# EAGLE board v8g (EAGLE 9.0.1), part 1 of 2
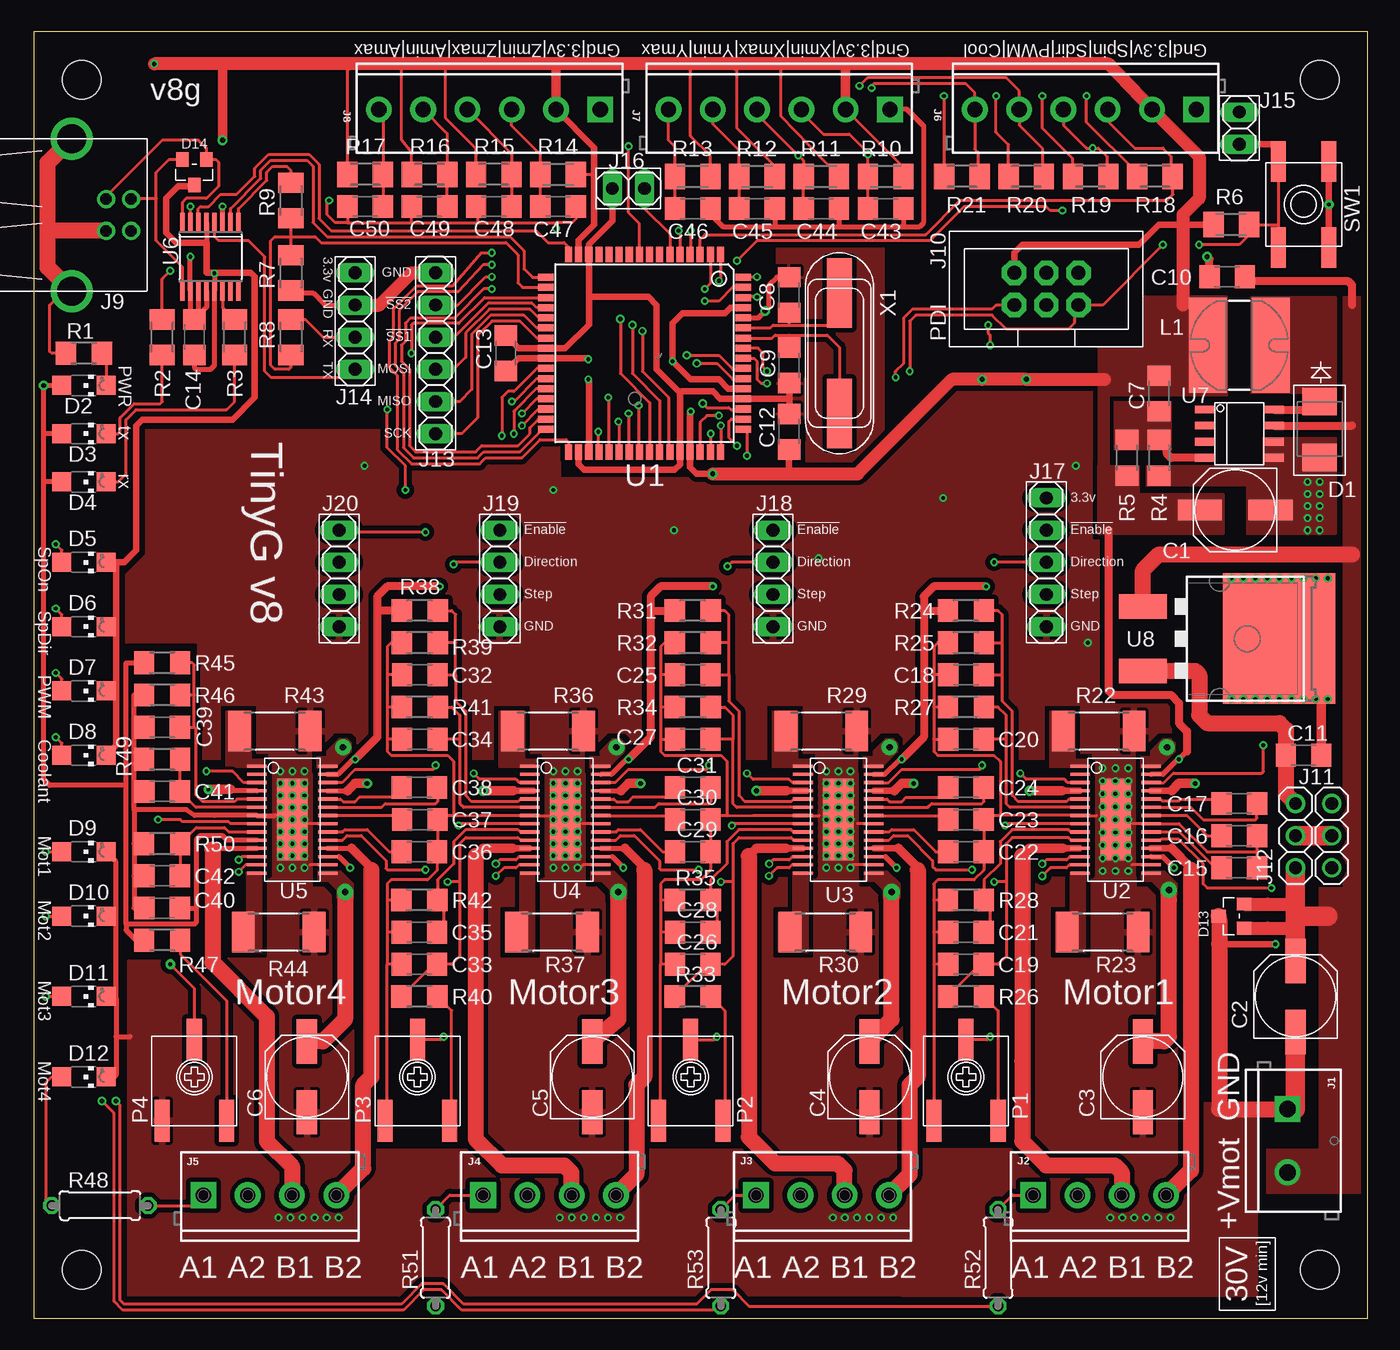
[diagram p4: board, top side]
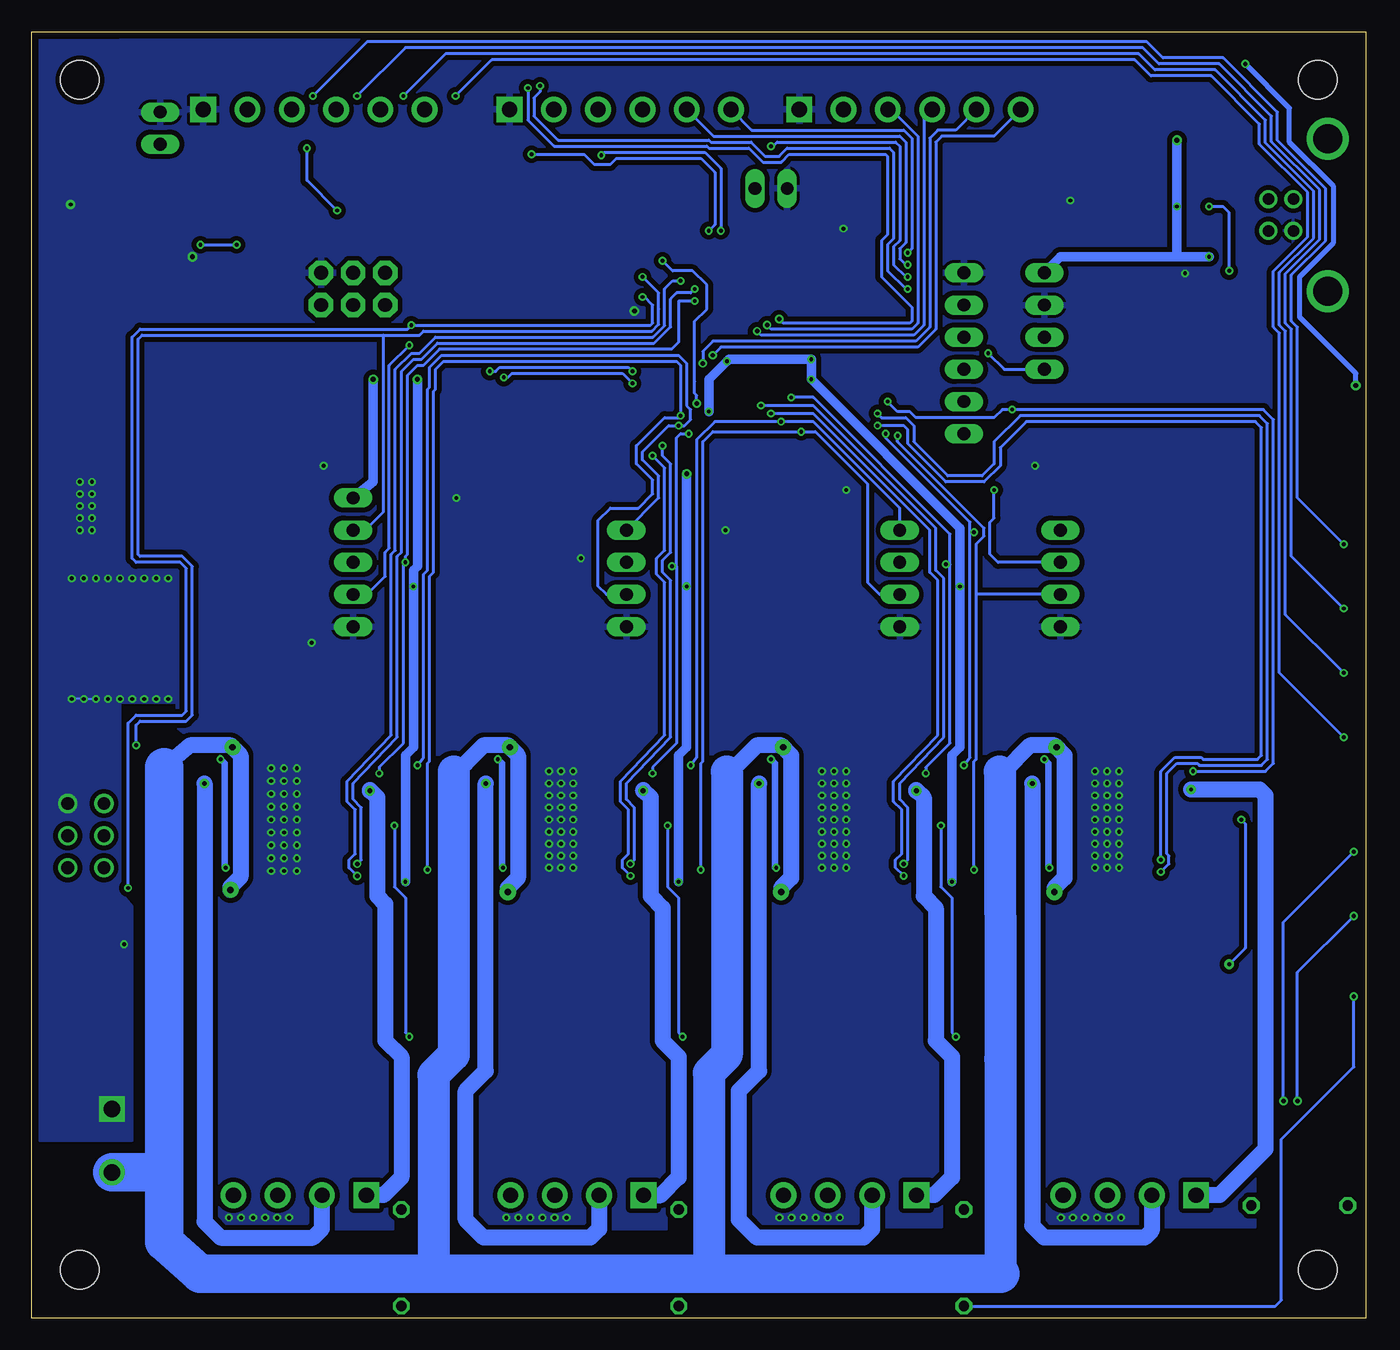
[diagram p5: board, bottom side, seen from below]

Size 105.41 x 101.6 mm. Coordinates in mm from the lower left corner, seen from the top.
Outline: 0,0 105.41,0 105.41,101.6 0,101.6 0,0
Copper layers (1*16): Top 0.035mm / dielectric 1.5mm / Bottom 0.035mm
Design rules "SeeedStudio_2layer_DRU_no_angle_20140221": minimum track width 6mil, minimum drill 12mil, track to track 6mil, track to pad 6mil, pad to pad 6mil, via to via 6mil, smd to smd 0mil, copper to edge 10mil, drill to drill 10mil, minimum pad ring 10mil, minimum via ring 6mil, stop-mask expansion 2mil, vias tented up to drill 100mil, thermal gap 10mil
Holes 3.05 mm at 3.81,3.81 3.81,97.79 101.6,3.81 101.6,97.79
tRestrict: area 58.9,69.4 to 60.5,70.6; area 58.9,74.6 to 60.5,75.9; area 58.9,80.2 to 60.5,81.4

## Footprints (pad centres in the part's own frame; a part is rotated, then mirrored left to right if it is on the bottom)
WCAP-ASLI = smd 3.5 x 1.6: + 2.8,0; - -2.8,0
C1206 = smd 1.6 x 1.8: 1 -1.4,0; 2 1.4,0
DO-214AA = smd 2.159 x 2.743: A 4.42,0; C 0,0
CHIPLED_1206 = smd 1.5 x 1.5: A 0,-1.75; C 0,1.75
SOT23 = smd 1.016 x 1.143: 1 -0.95,-1.016; 2 0.95,-1.016; 3 0,1.016
SCREWTERMINAL-5MM-2 = drill 1.3 pad 2.032 square: 1 0,0 | drill 1.3 pad 2.032: 2 5,0
SCREWTERMINAL-3.5MM-4 = drill 1.2 pad 2.032 square: 1 0,0 | drill 1.2 pad 2.032: 2 3.5,0; 3 7,0; 4 10.5,0
SCREWTERMINAL-3.5MM-6 = drill 1.2 pad 2.032 square: 1 0,0 | drill 1.2 pad 2.032: 2 3.5,0; 3 7,0; 4 10.5,0; 5 14,0; 6 17.5,0
USB-B-H = drill 0.914: D+ 0,1.25; D- 1.981,1.25; GND 0,-1.25; VBUS 1.981,-1.25 | drill 2.286: GND@0 -2.718,-6.02; GND@1 -2.718,6.02
IDC-6-PIN-61200621621 = drill 1.1 pad 1.93 octagon: 1 -2.54,-1.27; 2 -2.54,1.27; 3 0,-1.27; 4 0,1.27; 5 2.54,-1.27; 6 2.54,1.27
1X03 = drill 1.016: 1 -2.54,0; 2 0,0; 3 2.54,0
1X06 = drill 1.016 long: 1 -6.35,0; 2 -3.81,0; 3 -1.27,0; 4 1.27,0; 5 3.81,0; 6 6.35,0
1X04 = drill 1.016 long: 1 -3.81,0; 2 -1.27,0; 3 1.27,0; 4 3.81,0
1X02 = drill 1.016 long: 1 -1.27,0; 2 1.27,0
1X05 = drill 1.016 long: 1 -5.08,0; 2 -2.54,0; 3 0,0; 4 2.54,0; 5 5.08,0
SDE0805A = smd 3 x 7.5: 1 -2.5,0; 2 2.5,0
BOURNS_3361P = smd 1.19 x 3.3: 1 -2.54,-3.475; 2 0,2.93; 3 2.54,-3.475
R1206 = smd 1.6 x 1.803: 1 -1.422,0; 2 1.422,0
M1206 = smd 1.6 x 2: 1 -1.4,0; 2 1.4,0
R2512 = smd 1.8 x 3.2: 1 -2.8,0; 2 2.8,0
0207/7 = drill 0.813 octagon: 1 -3.81,0; 2 3.81,0
EVQ-Q2 = smd 3.2 x 1.2: A -3.4,-2; A' 3.4,-2; B -3.4,2; B' 3.4,2
TQFP-64A-64 = smd 1.194 x 0.559: 1 -7.8,6; 2 -7.8,5.2; 3 -7.8,4.4; 4 -7.8,3.6; 5 -7.8,2.8; 6 -7.8,2; 7 -7.8,1.2; 8 -7.8,0.4; 9 -7.8,-0.4; 10 -7.8,-1.2; 11 -7.8,-2; 12 -7.8,-2.8; 13 -7.8,-3.6; 14 -7.8,-4.4; 15 -7.8,-5.2; 16 -7.8,-6; 33 7.8,-6; 34 7.8,-5.2; 35 7.8,-4.4; 36 7.8,-3.6; 37 7.8,-2.8; 38 7.8,-2; 39 7.8,-1.2; 40 7.8,-0.4; 41 7.8,0.4; 42 7.8,1.2; 43 7.8,2; 44 7.8,2.8; 45 7.8,3.6; 46 7.8,4.4; 47 7.8,5.2; 48 7.8,6 | smd 0.559 x 1.194: 17 -6,-7.8; 18 -5.2,-7.8; 19 -4.4,-7.8; 20 -3.6,-7.8; 21 -2.8,-7.8; 22 -2,-7.8; 23 -1.2,-7.8; 24 -0.4,-7.8; 25 0.4,-7.8; 26 1.2,-7.8; 27 2,-7.8; 28 2.8,-7.8; 29 3.6,-7.8; 30 4.4,-7.8; 31 5.2,-7.8; 32 6,-7.8; 49 6,7.8; 50 5.2,7.8; 51 4.4,7.8; 52 3.6,7.8; 53 2.8,7.8; 54 2,7.8; 55 1.2,7.8; 56 0.4,7.8; 57 -0.4,7.8; 58 -1.2,7.8; 59 -2,7.8; 60 -2.8,7.8; 61 -3.6,7.8; 62 -4.4,7.8; 63 -5.2,7.8; 64 -6,7.8
HTSSOP_28-PIN = smd 0.25 x 1.55: 1 -4.225,-2.8; 2 -3.575,-2.8; 3 -2.925,-2.8; 4 -2.275,-2.8; 5 -1.625,-2.8; 6 -0.975,-2.8; 7 -0.325,-2.8; 8 0.325,-2.8; 9 0.975,-2.8; 10 1.625,-2.8; 11 2.275,-2.8; 12 2.925,-2.8; 13 3.575,-2.8; 14 4.225,-2.8; 15 4.225,2.8; 16 3.575,2.8; 17 2.925,2.8; 18 2.275,2.8; 19 1.625,2.8; 20 0.975,2.8; 21 0.325,2.8; 22 -0.325,2.8; 23 -0.975,2.8; 24 -1.625,2.8; 25 -2.275,2.8; 26 -2.925,2.8; 27 -3.575,2.8; 28 -4.225,2.8 | smd 6.46 x 2.4: 29 0,0
SSOP16 = smd 0.35 x 1.55: 1 -2.223,-2.7; 2 -1.587,-2.7; 3 -0.953,-2.7; 4 -0.318,-2.7; 5 0.318,-2.7; 6 0.953,-2.7; 7 1.587,-2.7; 8 2.223,-2.7; 9 2.223,2.7; 10 1.587,2.7; 11 0.953,2.7; 12 0.318,2.7; 13 -0.318,2.7; 14 -0.953,2.7; 15 -1.587,2.7; 16 -2.223,2.7
SOIC-8_NB = smd 0.6 x 1.52: 1 -1.905,-2.74; 2 -0.635,-2.74; 3 0.635,-2.74; 4 1.905,-2.74; 5 1.905,2.74; 6 0.635,2.74; 7 -0.635,2.74; 8 -1.905,2.74
D2PAK = smd 1.93 x 3.81: 1 -2.55,-8.25; 3 2.55,-8.25 | smd 10.3 x 8.9: 2 0,2.5
C4ST-SMD = smd 5.5 x 2: 1 -4.75,0; 2 4.75,0

## Placement (x,y rotation side)
C1  100 uF  [WCAP-ASLI]  94.93,63.82 180 top
C2  100 uF 35V  [WCAP-ASLI]  99.69,25.4 90 top
C3  100uF 35V  [WCAP-ASLI]  87.63,19.05 90 top
C4  100uF 35V  [WCAP-ASLI]  66.04,19.05 90 top
C5  100uF 35V  [WCAP-ASLI]  44.13,19.05 90 top
C6  100uF 35V  [WCAP-ASLI]  21.59,19.05 90 top
C7  4700 pF  [C1206]  88.9,73.03 90 top
C8  22pF  [C1206]  59.69,80.8 90 top
C9  22pF  [C1206]  59.69,75.25 270 top
C10  0.22 uF  [C1206]  94.3,82.23 180 top
C11  0.22 uF  [C1206]  100.33,44.45 0 top
C12  0.22 uF  [C1206]  59.69,70.01 90 top
C13  0.22 uF  [C1206]  37.31,76.2 90 top
C14  0.22 uF  [C1206]  12.7,77.47 270 top
C15  0.22 uF  [C1206]  95.25,35.56 0 top
C16  0.22 uF  [C1206]  95.25,38.1 0 top
C17  0.22 uF  [C1206]  95.25,40.64 0 top
C18  0.22 uF  [C1206]  73.66,50.8 0 top
C19  0.22 uF  [C1206]  73.66,27.94 0 top
C20  680 pF  [C1206]  73.66,45.72 0 top
C21  680 pF  [C1206]  73.66,30.48 0 top
C22  0.22 uF  [C1206]  73.66,36.83 0 top
C23  0.22 uF  [C1206]  73.66,39.37 0 top
C24  0.22 uF  [C1206]  73.66,41.91 0 top
C25  0.22 uF  [C1206]  52.07,50.8 0 top
C26  0.22 uF  [C1206]  52.07,27.94 0 top
C27  680 pF  [C1206]  52.07,45.72 0 top
C28  680 pF  [C1206]  52.07,30.48 0 top
C29  0.22 uF  [C1206]  52.07,36.83 0 top
C30  0.22 uF  [C1206]  52.07,39.37 0 top
C31  0.22 uF  [C1206]  52.07,41.91 0 top
C32  0.22 uF  [C1206]  30.51,50.8 0 top
C33  0.22 uF  [C1206]  30.48,27.94 0 top
C34  680 pF  [C1206]  30.51,45.72 0 top
C35  680 pF  [C1206]  30.48,30.48 0 top
C36  0.22 uF  [C1206]  30.48,36.83 0 top
C37  0.22 uF  [C1206]  30.51,39.37 0 top
C38  0.22 uF  [C1206]  30.48,41.91 0 top
C39  0.22 uF  [C1206]  10.16,46.67 0 top
C40  0.22 uF  [C1206]  10.16,32.38 0 top
C41  680 pF  [C1206]  10.16,41.59 0 top
C42  680 pF  [C1206]  10.16,34.92 0 top
C43  0.22 uF  [C1206]  67.31,87.63 180 top
C44  0.22 uF  [C1206]  62.23,87.63 180 top
C45  0.22 uF  [C1206]  57.15,87.63 180 top
C46  0.22 uF  [C1206]  52.07,87.63 180 top
C47  0.22 uF  [C1206]  41.43,87.79 180 top
C48  0.22 uF  [C1206]  36.35,87.79 0 top
C49  0.22 uF  [C1206]  31.27,87.79 0 top
C50  0.22 uF  [C1206]  26.19,87.79 0 top
D1  MBRS140  [DO-214AA]  101.6,72.39 270 top
D2  BLUE  [CHIPLED_1206]  3.97,73.66 270 top
D3  RED  [CHIPLED_1206]  3.97,69.85 270 top
D4  RED  [CHIPLED_1206]  3.97,66.04 270 top
D5  RED  [CHIPLED_1206]  3.97,59.69 270 top
D6  RED  [CHIPLED_1206]  3.97,54.61 270 top
D7  RED  [CHIPLED_1206]  3.97,49.53 270 top
D8  RED  [CHIPLED_1206]  3.97,44.45 270 top
D9  GRN  [CHIPLED_1206]  3.97,36.83 270 top
D10  GRN  [CHIPLED_1206]  3.97,31.75 270 top
D11  GRN  [CHIPLED_1206]  3.97,25.4 270 top
D12  GRN  [CHIPLED_1206]  3.97,19.05 270 top
D13  GSOT24C  [SOT23]  94.61,31.75 90 top
D14  PESDxL2BT  [SOT23]  12.7,90.49 180 top
J1  VMOT  [SCREWTERMINAL-5MM-2]  99.06,16.51 270 top
J2  M1OUT  [SCREWTERMINAL-3.5MM-4]  78.97,9.7 0 top
J3  M2OUT  [SCREWTERMINAL-3.5MM-4]  57.07,9.7 0 top
J4  M3OUT  [SCREWTERMINAL-3.5MM-4]  35.51,9.7 0 top
J5  M4OUT  [SCREWTERMINAL-3.5MM-4]  13.41,9.7 0 top
J6  PWM  [SCREWTERMINAL-3.5MM-6]  91.86,95.45 180 top
J7  XY switches  [SCREWTERMINAL-3.5MM-6]  67.65,95.45 180 top
J8  ZA switches  [SCREWTERMINAL-3.5MM-6]  44.77,95.45 180 top
J9  USB  [USB-B-H]  5.71,87.12 0 top
J10  PDI  [IDC-6-PIN-61200621621]  80.01,81.28 0 top
J11  VOUT  [1X03]  102.55,38.1 90 top
J12  VSEL  [1X03]  99.69,38.1 90 top
J13  SPI  [1X06]  31.75,76.2 270 top
J14  TTL Serial  [1X04]  25.4,78.74 90 top
J15  Reset  [1X02]  95.25,93.98 90 top
J16  Boot  [1X02]  46.99,89.22 0 top
J17  M1CONN  [1X05]  80.01,59.69 90 top
J18  M2CONN  [1X04]  58.42,58.42 90 top
J19  M3CONN  [1X04]  36.83,58.42 90 top
J20  M4CONN  [1X04]  24.13,58.42 90 top
L1  150 uH  [SDE0805A]  95.25,76.83 180 top
P1  10k  [BOURNS_3361P]  73.66,19.05 0 top
P2  10k  [BOURNS_3361P]  51.91,19.05 0 top
P3  10k  [BOURNS_3361P]  30.32,19.05 0 top
P4  10k  [BOURNS_3361P]  12.7,19.05 0 top
R1  150 ohm  [R1206]  3.97,76.2 0 top
R2  150 ohm  [M1206]  10.16,77.47 270 top
R3  150 ohm  [M1206]  15.88,77.47 270 top
R4  1k  [R1206]  88.9,67.94 90 top
R5  1.74k  [R1206]  86.36,67.94 90 top
R6  56k  [M1206]  94.61,86.36 0 top
R7  2.7k  [M1206]  20.32,82.55 90 top
R8  2.7k  [M1206]  20.32,77.47 90 top
R9  2.7k  [M1206]  20.32,88.27 90 top
R10  2.7k  [M1206]  67.31,90.17 180 top
R11  2.7k  [M1206]  62.23,90.17 180 top
R12  2.7k  [M1206]  57.15,90.17 180 top
R13  2.7k  [M1206]  52.07,90.17 180 top
R14  2.7k  [M1206]  41.43,90.33 180 top
R15  2.7k  [M1206]  36.35,90.33 0 top
R16  2.7k  [M1206]  31.27,90.33 0 top
R17  2.7k  [M1206]  26.19,90.33 0 top
R18  150 ohm  [M1206]  88.58,90.17 0 top
R19  150 ohm  [M1206]  83.5,90.17 0 top
R20  150 ohm  [M1206]  78.42,90.17 0 top
R21  150 ohm  [M1206]  73.34,90.17 0 top
R22  0.1 ohm 3W  [R2512]  84.14,46.35 180 top
R23  0.1 ohm 3W  [R2512]  84.45,30.48 180 top
R24  4.7k  [R1206]  73.66,55.88 0 top
R25  4.7k  [R1206]  73.66,53.34 0 top
R26  2.7k  [R1206]  73.66,25.4 0 top
R27  56k  [R1206]  73.66,48.26 0 top
R28  56k  [R1206]  73.66,33.02 0 top
R29  0.1 ohm 3W  [R2512]  62.23,46.35 180 top
R30  0.1 ohm 3W  [R2512]  62.55,30.48 180 top
R31  4.7k  [R1206]  52.07,55.88 0 top
R32  4.7k  [R1206]  52.07,53.34 0 top
R33  2.7k  [R1206]  52.07,25.4 0 top
R34  56k  [R1206]  52.07,48.26 0 top
R35  56k  [R1206]  52.07,33.02 0 top
R36  0.1 ohm 3W  [R2512]  40.64,46.35 180 top
R37  0.1 ohm 3W  [R2512]  40.96,30.48 180 top
R38  4.7k  [R1206]  30.51,55.88 0 top
R39  4.7k  [R1206]  30.51,53.34 0 top
R40  2.7k  [R1206]  30.48,25.4 0 top
R41  56k  [R1206]  30.51,48.26 0 top
R42  56k  [R1206]  30.48,33.02 0 top
R43  0.1 ohm 3W  [R2512]  19.05,46.35 180 top
R44  0.1 ohm 3W  [R2512]  19.37,30.48 180 top
R45  4.7k  [R1206]  10.16,51.75 0 top
R46  4.7k  [R1206]  10.16,49.21 0 top
R47  2.7k  [R1206]  10.16,29.84 0 top
R48  2.7k  [0207/7]  5.24,8.89 0 top
R49  56k  [R1206]  10.16,44.13 0 top
R50  56k  [R1206]  10.16,37.47 0 top
R51  2.7k  [0207/7]  31.75,4.76 90 top
R52  2.7k  [0207/7]  76.2,4.76 90 top
R53  2.7k  [0207/7]  54.29,4.76 90 top
SW1  [EVQ-Q2]  100.33,87.95 90 top
U1  ATXMEGA192A3-AU  [TQFP-64A-64]  48.26,76.2 270 top
U2  DRV8818  [HTSSOP_28-PIN]  85.47,39.37 270 top
U3  DRV8818  [HTSSOP_28-PIN]  63.58,39.37 270 top
U4  DRV8818  [HTSSOP_28-PIN]  42.01,39.37 270 top
U5  DRV8818  [HTSSOP_28-PIN]  20.45,39.37 270 top
U6  FT230XS  [SSOP16]  13.97,83.82 180 top
U7  LM2594  [SOIC-8_NB]  95.25,69.85 270 top
U8  7812  [D2PAK]  95.89,53.66 270 top
X1  16 MHz  [C4ST-SMD]  63.66,76.2 270 top